# EAGLE design SHT Test Module (EAGLE 8.3.2)
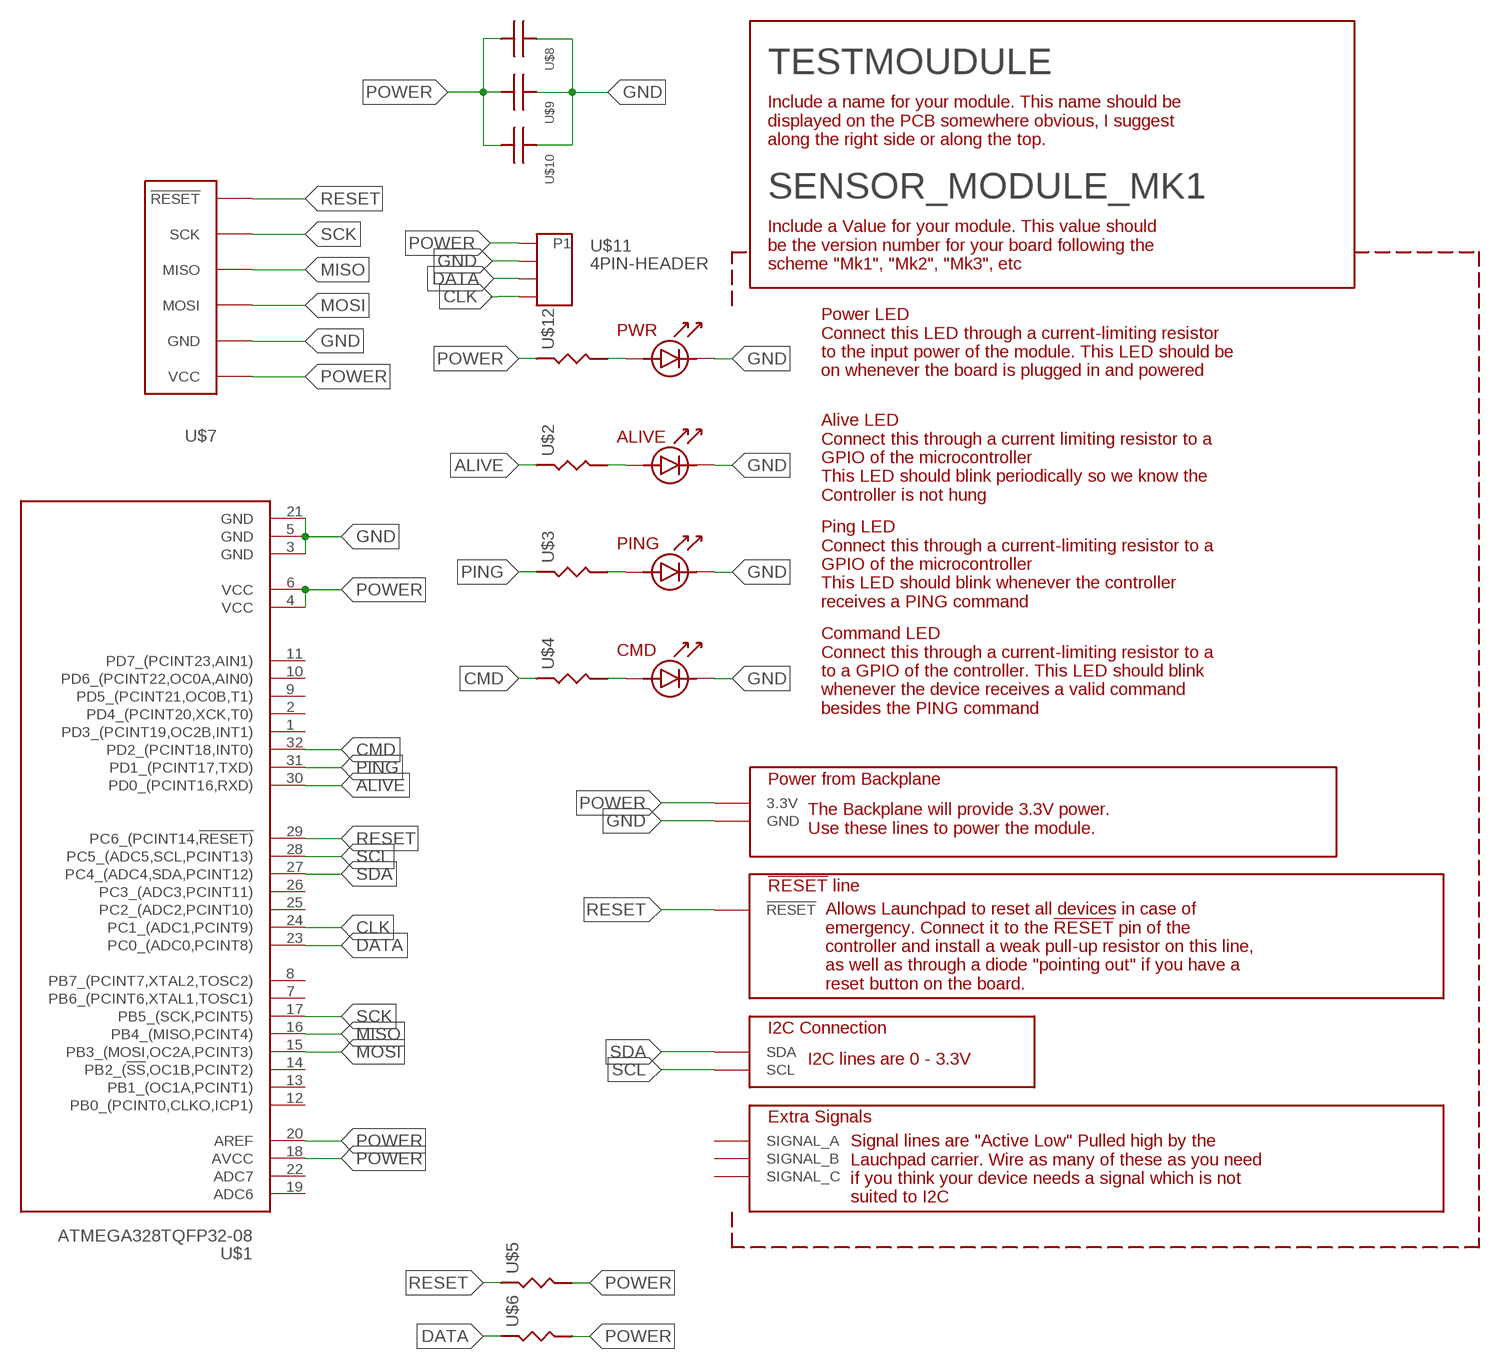
[diagram p0: schematic, sheet 1]

## Parts
TESTMOUDULE  SENSOR_MODULE_MK1  [SENSOR_MODULE_MK1]
U$1  ATMEGA328TQFP32-08  [TQFP32-08]
U$2  RESISTOR  [0805_STACKPOLERESISTOR]
U$3  RESISTOR  [0805_STACKPOLERESISTOR]
U$4  RESISTOR  [0805_STACKPOLERESISTOR]
U$5  RESISTOR  [0805_STACKPOLERESISTOR]
U$6  RESISTOR  [0805_STACKPOLERESISTOR]
U$7  ISP_PROGRAMMING_HEADER  [6PINHEADER_CORRECT]
U$8  CAPACITOR-UNPOLARIZED0805  [0805_STACKPOLERESISTOR]
U$9  CAPACITOR-UNPOLARIZED0805  [0805_STACKPOLERESISTOR]
U$10  CAPACITOR-UNPOLARIZED0805  [0805_STACKPOLERESISTOR]
U$11  4PIN-HEADER  [4HEADER_10MIL]
U$12  RESISTOR  [0805_STACKPOLERESISTOR]

## Nets
ALIVE: U$1.30(PD0_(PCINT16,RXD)) U$2.P$1
CLK: U$1.24(PC1_(ADC1,PCINT9)) U$11.P$4
CMD: U$1.32(PD2_(PCINT18,INT0)) U$4.P$1
DATA: U$1.23(PC0_(ADC0,PCINT8)) U$6.P$1 U$11.P$3
GND: TESTMOUDULE.ALIVELED_CATHODE TESTMOUDULE.CMDLED_CATHODE TESTMOUDULE.GND TESTMOUDULE.PINGLED_CATHODE TESTMOUDULE.PWRLED_CATHODE U$1.3(GND) U$1.5(GND) U$1.21(GND) U$7.6(GND) U$8.P$1 U$9.P$1 U$10.P$1 U$11.P$2
MISO: U$1.16(PB4_(MISO,PCINT4)) U$7.1(MISO)
MOSI: U$1.15(PB3_(MOSI,OC2A,PCINT3)) U$7.4(MOSI)
N$12: TESTMOUDULE.PWRLED_ANODE U$12.P$2
N$13: TESTMOUDULE.ALIVELED_ANODE U$2.P$2
N$14: TESTMOUDULE.PINGLED_ANODE U$3.P$2
N$15: TESTMOUDULE.CMDLED_ANODE U$4.P$2
PING: U$1.31(PD1_(PCINT17,TXD)) U$3.P$1
POWER: TESTMOUDULE.3P3V(3.3V) U$1.4(VCC) U$1.6(VCC) U$1.18(AVCC) U$1.20(AREF) U$5.P$2 U$6.P$2 U$7.2(VCC) U$8.P$2 U$9.P$2 U$10.P$2 U$11.P$1(P1) U$12.P$1
RESET: TESTMOUDULE.RESET(!RESET) U$1.29(PC6_(PCINT14,!RESET)) U$5.P$1 U$7.5(!RESET)
SCK: U$1.17(PB5_(SCK,PCINT5)) U$7.3(SCK)
SCL: TESTMOUDULE.SCL U$1.28(PC5_(ADC5,SCL,PCINT13))
SDA: TESTMOUDULE.SDA U$1.27(PC4_(ADC4,SDA,PCINT12))
Unconnected: TESTMOUDULE.A(SIGNAL_A) TESTMOUDULE.B(SIGNAL_B) TESTMOUDULE.C(SIGNAL_C) U$1.1(PD3_(PCINT19,OC2B,INT1)) U$1.2(PD4_(PCINT20,XCK,T0)) U$1.7(PB6_(PCINT6,XTAL1,TOSC1)) U$1.8(PB7_(PCINT7,XTAL2,TOSC2)) U$1.9(PD5_(PCINT21,OC0B,T1)) U$1.10(PD6_(PCINT22,OC0A,AIN0)) U$1.11(PD7_(PCINT23,AIN1)) U$1.12(PB0_(PCINT0,CLKO,ICP1)) U$1.13(PB1_(OC1A,PCINT1)) U$1.14(PB2_(!SS,OC1B,PCINT2)) U$1.19(ADC6) U$1.22(ADC7) U$1.25(PC2_(ADC2,PCINT10)) U$1.26(PC3_(ADC3,PCINT11))

## Library data of the parts
TESTMOUDULE = 000_CustomPartsMaster:SENSOR_MODULE_MK1
U$1 = 000_CustomPartsMaster:ATMEGA328
U$2-U$6 U$12 = 000_CustomPartsMaster:RESISTOR
U$7 = 000_CustomPartsMaster:ISP_PROGRAMMING_HEADER
U$8-U$10 = 000_CustomPartsMaster:CAPACITOR-UNPOLARIZED
U$11 = 000_CustomPartsMaster:4PIN-HEADER

## Board
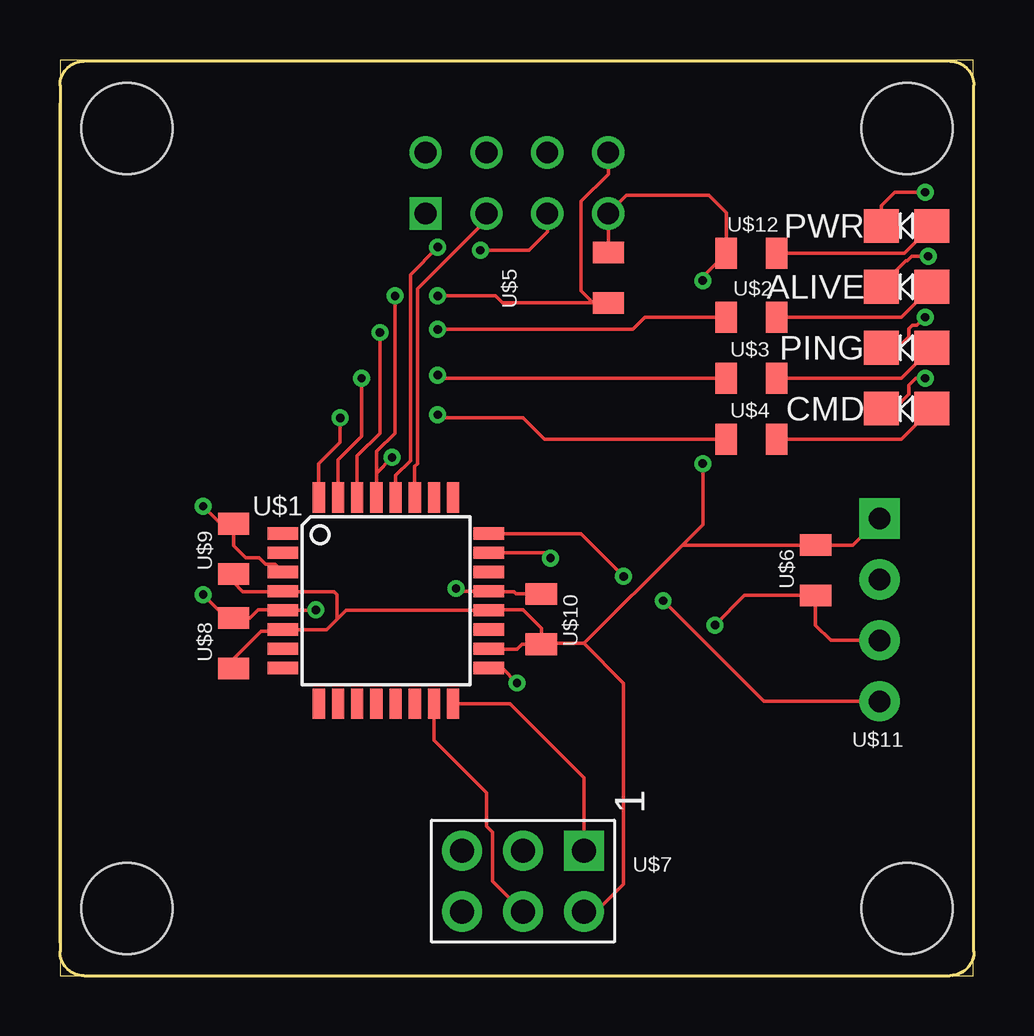
[diagram p1: board, top side]
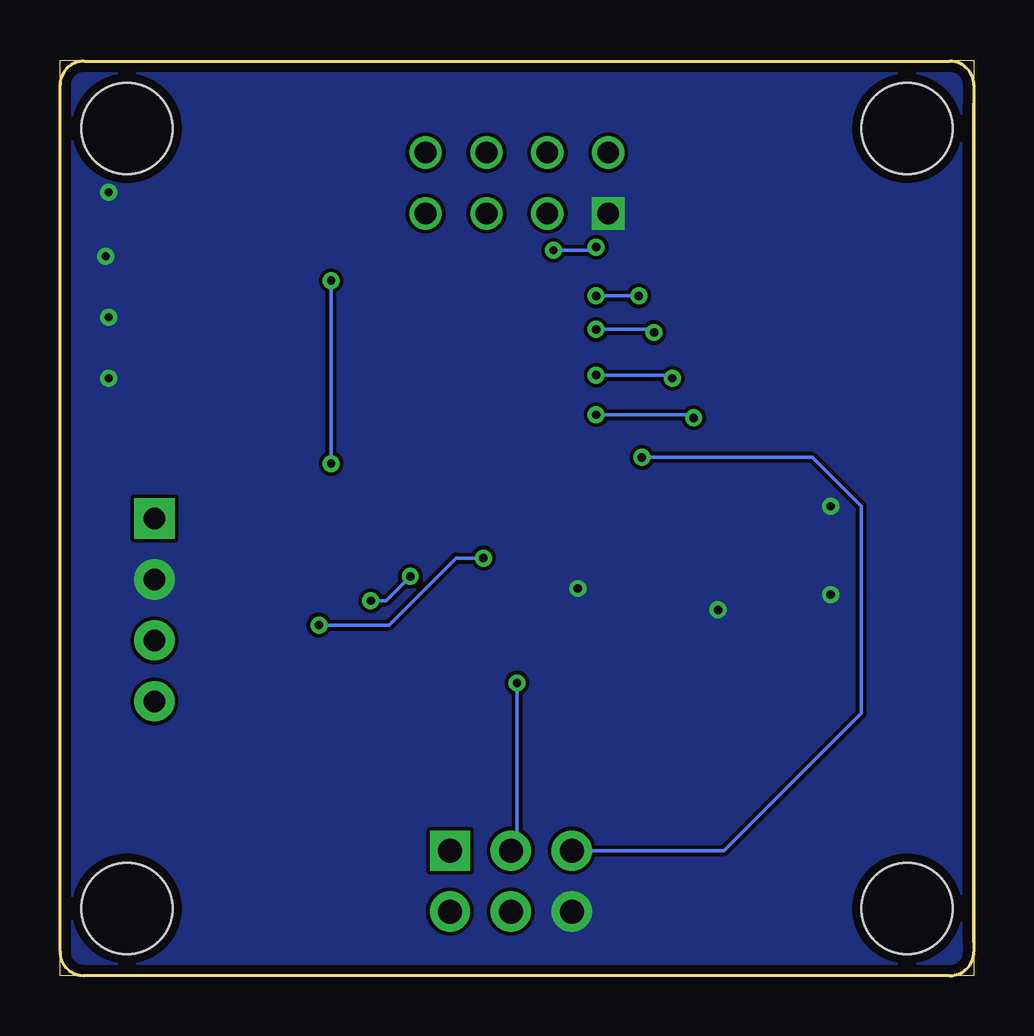
[diagram p2: board, bottom side, seen from below]

Size 38.1 x 38.15 mm. Coordinates in mm from the lower left corner, seen from the top.
Outline: 0,0 38.08,0 38.08,38.15 0,38.15 0,36.32 0,1.4 0,0
Copper layers (1*16): Top 0.0356mm / dielectric 1.5011mm / Bottom 0.0356mm
Design rules "LaenPCBOrder": minimum track width 6mil, minimum drill 13mil, track to track 6mil, track to pad 6mil, pad to pad 6mil, via to via 6mil, smd to smd 6mil, copper to edge 15mil, drill to drill 6mil, minimum pad ring 7mil, minimum via ring 7mil, stop-mask expansion 3mil, vias tented up to drill 0mil, thermal gap 10mil

### Footprints (pad centres in the part's own frame; a part is rotated, then mirrored left to right if it is on the bottom)
SENSOR_MODULE_MK1 = drill 0.9: 3P3V 22.86,31.75; A 20.32,34.29; B 17.78,34.29; C 15.24,34.29; RESET 22.86,34.29; SCL 20.32,31.75; SDA 17.78,31.75 | smd 1.45 x 1.4: ALIVELED_ANODE 36.343,28.702; ALIVELED_CATHODE 34.243,28.702; CMDLED_ANODE 36.343,23.622; CMDLED_CATHODE 34.243,23.622; PINGLED_ANODE 36.343,26.162; PINGLED_CATHODE 34.243,26.162; PWRLED_ANODE 36.343,31.242; PWRLED_CATHODE 34.243,31.242 | drill 0.9 square: GND 15.24,31.75 | hole 3.797: 2.794,2.794; 35.306,2.794; 2.794,35.306; 35.306,35.306
TQFP32-08 = smd 1.27 x 0.508: 1 -4.293,2.8; 2 -4.293,2; 3 -4.293,1.2; 4 -4.293,0.4; 5 -4.293,-0.4; 6 -4.293,-1.2; 7 -4.293,-2; 8 -4.293,-2.8; 17 4.293,-2.8; 18 4.293,-2; 19 4.293,-1.2; 20 4.293,-0.4; 21 4.293,0.4; 22 4.293,1.2; 23 4.293,2; 24 4.293,2.8 | smd 0.508 x 1.27: 9 -2.8,-4.293; 10 -2,-4.293; 11 -1.2,-4.293; 12 -0.4,-4.293; 13 0.4,-4.293; 14 1.2,-4.293; 15 2,-4.293; 16 2.8,-4.293; 25 2.8,4.293; 26 2,4.293; 27 1.2,4.293; 28 0.4,4.293; 29 -0.4,4.293; 30 -1.2,4.293; 31 -2,4.293; 32 -2.8,4.293
0805_STACKPOLERESISTOR = smd 0.9 x 1.3: P$1 -1.05,0; P$2 1.05,0
6PINHEADER_CORRECT = drill 1 pad 1.676 square: 1 0,0 | drill 1 pad 1.676: 2 2.54,0; 3 0,-2.54; 4 2.54,-2.54; 5 0,-5.08; 6 2.54,-5.08
4HEADER_10MIL = drill 0.9 pad 1.676 square: P$1 0,3.81 | drill 0.9 pad 1.676: P$2 0,1.27; P$3 0,-1.27; P$4 0,-3.81

### Placement (x,y rotation side)
TESTMOUDULE  0,0 0 top
U$1  13.59,15.62 0 top
U$2  28.83,27.43 0 top
U$3  28.83,24.89 0 top
U$4  28.83,22.35 0 top
U$5  22.86,29.08 90 top
U$6  31.5,16.89 90 top
U$7  21.84,5.21 270 top
U$8  7.24,13.84 270 top
U$9  7.24,17.78 270 top
U$10  20.07,14.86 270 top
U$11  34.16,15.24 0 top
U$12  28.83,30.1 0 top

### Tracks (layer width: path | path; a pad name or v marks a point on that pad's centre or on a via)
ALIVE  (via drill 0.35)
  Top 0.152: U$2.P$1 24.38,27.43 23.88,26.92 v15.75,26.92 | U$1.30 12.39,21.66 13.34,22.61 v13.34,26.8
  Bottom 0.152: v15.75,26.92 13.46,26.92 v13.34,26.8
CLK  (via drill 0.35)
  Top 0.152: U$11.P$4 29.34,11.43 v25.15,15.62 | U$1.24 21.71,18.42 v23.5,16.64
  Bottom 0.152: v25.15,15.62 24.51,15.62 v23.5,16.64
CMD  (via drill 0.35)
  Top 0.152: U$1.32 10.79,21.33 11.68,22.23 v11.68,23.24 | U$4.P$1 20.19,22.35 19.3,23.24 15.88,23.24 v15.75,23.37
  Bottom 0.152: v15.75,23.37 11.81,23.37 v11.68,23.24
DATA  (via drill 0.35)
  Top 0.152: U$11.P$3 32.13,13.97 31.5,14.61 U$6.P$1 28.54,15.84 v27.3,14.61 | U$1.23 20.23,17.62 v20.45,17.4
  Bottom 0.152: v27.3,14.61 24.38,14.61 21.59,17.4 v20.45,17.4
GND  (via drill 0.35)
  Top 0.152: TESTMOUDULE.CMDLED_CATHODE 34.8,23.62 35.39,24.21 35.39,24.59 35.69,24.89 v36.07,24.89 | TESTMOUDULE.PINGLED_CATHODE 34.92,26.16 35.39,26.63 35.39,26.96 35.52,27.09 35.73,27.09 v36.07,27.43 | TESTMOUDULE.ALIVELED_CATHODE 34.24,28.78 35.26,29.79 35.33,29.79 35.5,29.97 v36.2,29.97 | TESTMOUDULE.PWRLED_CATHODE 34.24,32.08 34.8,32.64 v36.07,32.64 | U$9.P$1 7.24,17.91 7.74,17.41 8.3,17.41 8.57,17.14 8.98,17.14 U$1.3 | U$9.P$1 6.95,18.83 | U$10.P$1 19.02,15.91 18.92,16 17.9,16 U$1.21 16.62,16.02 v16.51,16.13 | v10.67,15.24 10.65,15.22 U$1.5 9.28,15.24 8.26,15.24 7.91,14.89 U$8.P$1 6.95,14.89 v5.97,15.88 | U$9.P$1 6.7,18.83 v5.97,19.56
  pour Bottom (no thermals): 0,34.92 0,37.08 arc-90 1.02,38.1 2.92,38.1 37.08,38.1 arc-90 38.1,37.08 38.1,36.58 38.1,1.02 arc-90 37.08,0 35.81,0 1.02,0 arc-90 0,1.02 0,1.52
MISO
  Top 0.152: U$1.16 18.77,11.33 21.84,8.26 U$7.1
MOSI
  Top 0.152: U$1.15 15.59,9.81 17.78,7.62 17.78,6.22 18.03,5.97 18.03,3.94 U$7.4
N$12
  Top 0.152: U$12.P$2 35.2,30.1 TESTMOUDULE.PWRLED_ANODE
N$13
  Top 0.152: U$2.P$2 35.07,27.43 TESTMOUDULE.ALIVELED_ANODE
N$14
  Top 0.152: U$3.P$2 35.07,24.89 TESTMOUDULE.PINGLED_ANODE
N$15
  Top 0.152: U$4.P$2 35.07,22.35 TESTMOUDULE.CMDLED_ANODE
PING  (via drill 0.35)
  Top 0.152: U$3.P$1 15.88,24.89 v15.75,25.02 | U$1.31 11.59,21.5 12.57,22.48 v12.57,24.89
  Bottom 0.152: v15.75,25.02 12.7,25.02 v12.57,24.89
POWER  (via drill 0.35)
  Top 0.152: U$5.P$2 22.86,31.62 22.92,31.69 TESTMOUDULE.3P3V 23.62,32.51 27.05,32.51 27.78,31.78 U$12.P$1 26.8,29.12 v26.8,28.96 | U$9.P$2 7.24,16.38 7.62,16 9.28,16 U$1.4 9.31,16 11.43,16 11.56,15.88 11.56,14.86 | U$8.P$2 7.24,13.21 8.38,14.35 9.23,14.35 U$1.6 11.12,14.42 11.56,14.86 | U$10.P$2 19.27,13.81 19.05,13.59 17.91,13.59 U$1.18 | U$10.P$2 20.07,14.48 19.3,15.24 17.9,15.24 U$1.20 11.92,15.22 11.56,14.86 | U$11.P$1 33.05,17.94 U$6.P$2 25.94,17.94 | 21.84,13.84 25.94,17.94 | 21.84,13.84 20.1,13.84 U$10.P$2 | v26.8,21.34 26.8,18.8 25.94,17.94 | U$7.2 22.35,2.67 23.5,3.81 23.5,12.19 21.84,13.84
  Bottom 0.152: v26.8,21.34 v26.8,28.96
RESET  (via drill 0.35)
  Top 0.152: 22.84,28.01 U$5.P$1 | 22.83,28.07 U$5.P$1 | 22.23,28.03 U$5.P$1 | 22.23,28.03 18.45,28.03 18.16,28.32 v15.75,28.32 | v13.97,28.32 13.97,22.61 13.21,21.84 13.21,19.93 U$1.29 13.19,20.94 v13.84,21.59 | TESTMOUDULE.RESET 22.86,33.4 21.72,32.26 21.72,28.54 22.23,28.03
  Bottom 0.152: v15.75,28.32 v13.97,28.32 | U$7.5 10.41,5.21 4.7,10.92 4.7,19.56 6.73,21.59 v13.84,21.59
SCK  (via drill 0.35)
  Top 0.152: U$1.17 18.42,12.82 v19.05,12.19
  Bottom 0.152: v19.05,12.19 19.05,5.46 U$7.3
SCL  (via drill 0.35)
  Top 0.152: TESTMOUDULE.SCL 20.32,30.99 19.56,30.23 v17.53,30.23 | U$1.28 13.99,20.85 14.61,21.46 14.61,29.21 v15.75,30.35
  Bottom 0.152: v17.53,30.23 15.88,30.23 v15.75,30.35
SDA
  Top 0.152: TESTMOUDULE.SDA 17.78,31.5 14.91,28.63 14.91,21.34 14.79,21.22 U$1.27 14.99,20.11